# EAGLE schematic main (EAGLE 9.4.2), part 2 of 2
## Sheet 10 of 11: V & F Registers
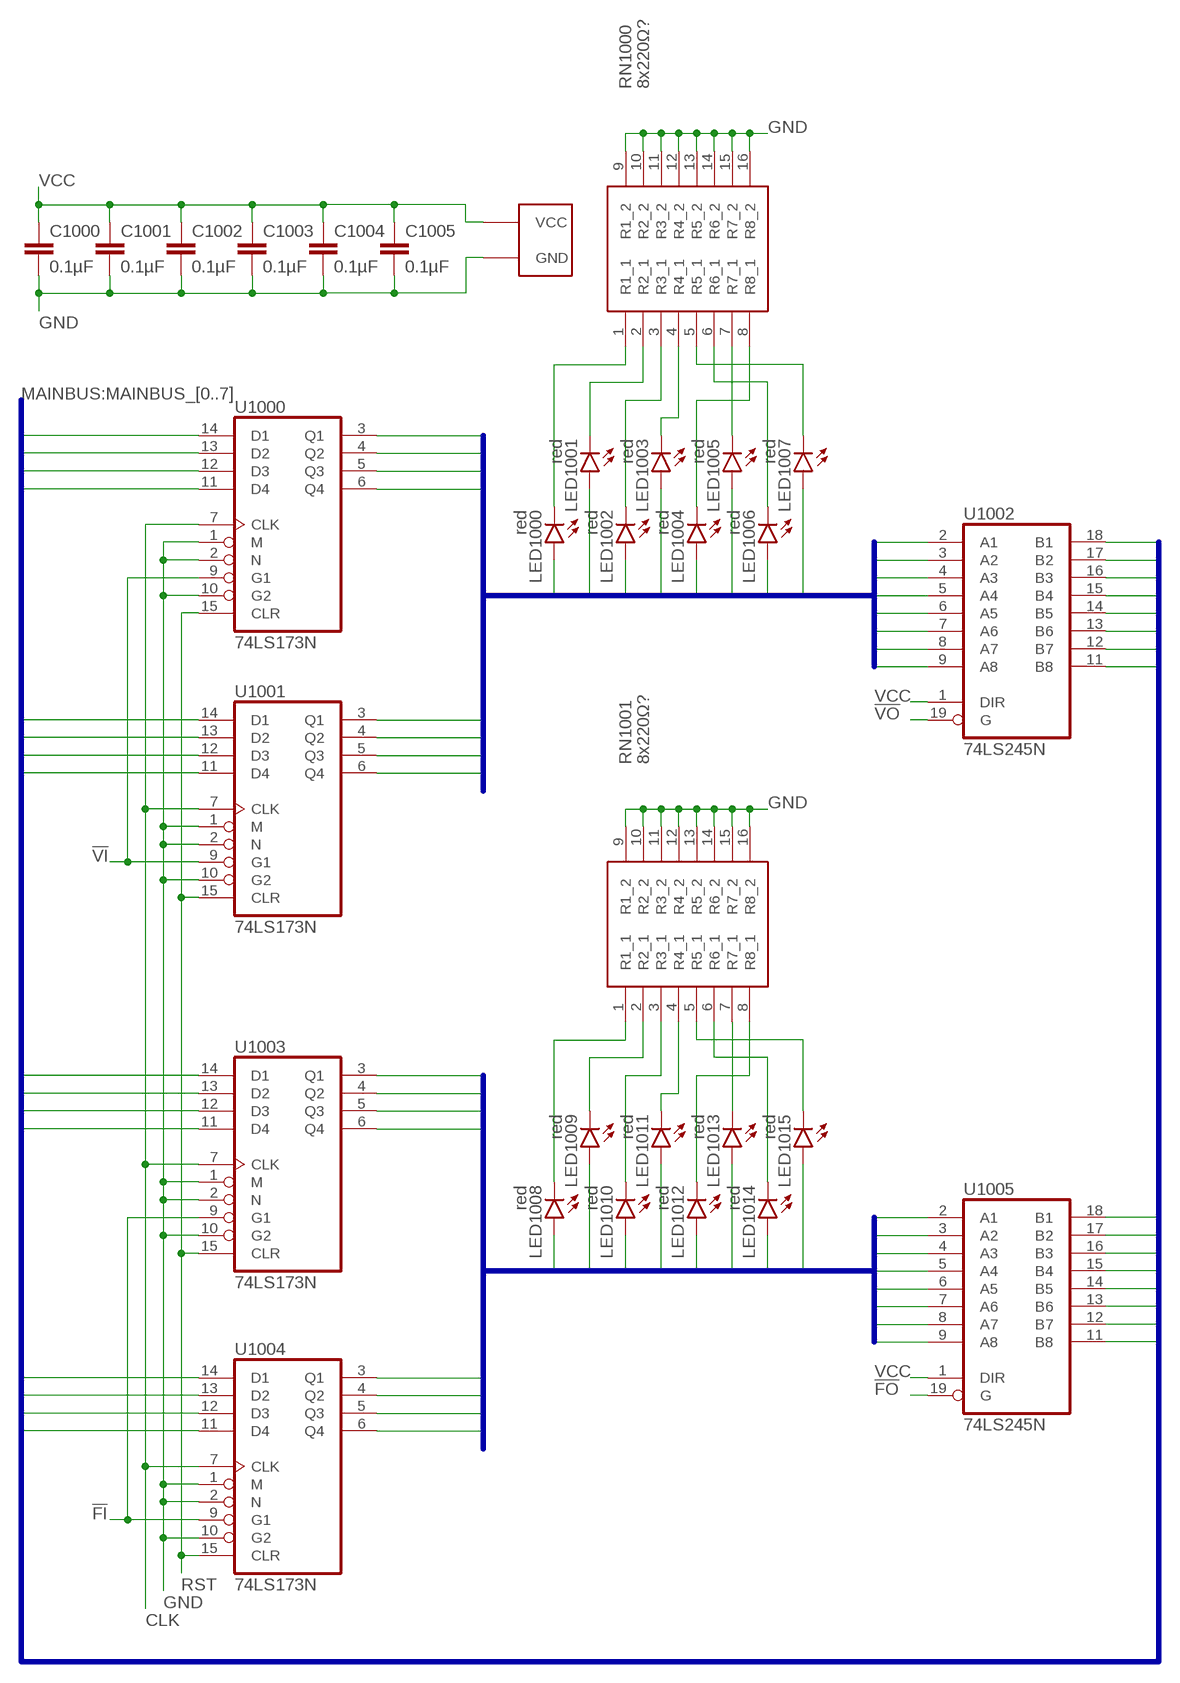
[diagram p10: schematic, sheet 10]

### Parts
C1000  0.1µF  C-EUC0805K  [C0805K]
C1001  0.1µF  C-EUC0805K  [C0805K]
C1002  0.1µF  C-EUC0805K  [C0805K]
C1003  0.1µF  C-EUC0805K  [C0805K]
C1004  0.1µF  C-EUC0805K  [C0805K]
C1005  0.1µF  C-EUC0805K  [C0805K]
LED1000  red  LED3MM  [LED3MM]
LED1001  red  LED3MM  [LED3MM]
LED1002  red  LED3MM  [LED3MM]
LED1003  red  LED3MM  [LED3MM]
LED1004  red  LED3MM  [LED3MM]
LED1005  red  LED3MM  [LED3MM]
LED1006  red  LED3MM  [LED3MM]
LED1007  red  LED3MM  [LED3MM]
LED1008  red  LED3MM  [LED3MM]
LED1009  red  LED3MM  [LED3MM]
LED1010  red  LED3MM  [LED3MM]
LED1011  red  LED3MM  [LED3MM]
LED1012  red  LED3MM  [LED3MM]
LED1013  red  LED3MM  [LED3MM]
LED1014  red  LED3MM  [LED3MM]
LED1015  red  LED3MM  [LED3MM]
RN1000  8x220Ω?  CAY16-102J8LF  [CAY16102J8LF]
RN1001  8x220Ω?  CAY16-102J8LF  [CAY16102J8LF]
U1000  74LS173N  [DIL16]
U1001  74LS173N  [DIL16]
U1002  74LS245N  [DIL20]
U1003  74LS173N  [DIL16]
U1004  74LS173N  [DIL16]
U1005  74LS245N  [DIL20]

### Nets
!FI: U1003.9(G1) U1004.9(G1) ; also sheet 11
!FO: U1005.19(G) ; also sheet 11
!VI: U1000.9(G1) U1001.9(G1) ; also sheet 11
!VO: U1002.19(G) ; also sheet 11
CLK: U1000.7(CLK) U1001.7(CLK) U1003.7(CLK) U1004.7(CLK) ; also sheet 1,2,3,4,5,6,7,9,11
GND: C1000.2 C1001.2 C1002.2 C1003.2 C1004.2 C1005.2 RN1000.9(R1_2) RN1000.10(R2_2) RN1000.11(R3_2) RN1000.12(R4_2) RN1000.13(R5_2) RN1000.14(R6_2) RN1000.15(R7_2) RN1000.16(R8_2) RN1001.9(R1_2) RN1001.10(R2_2) RN1001.11(R3_2) RN1001.12(R4_2) RN1001.13(R5_2) RN1001.14(R6_2) RN1001.15(R7_2) RN1001.16(R8_2) U1000.1(M) U1000.2(N) U1000.10(G2) U1001.1(M) U1001.2(N) U1001.10(G2) U1003.1(M) U1003.2(N) U1003.10(G2) U1004.1(M) U1004.2(N) U1004.10(G2) ; supply symbol labelled SUPPLY ; also sheet 1,2,3,4,5,6,7,8,9,11
LED1000_GND: LED1000.K(C) RN1000.1(R1_1)
LED1001_GND: LED1001.K(C) RN1000.2(R2_1)
LED1002_GND: LED1002.K(C) RN1000.3(R3_1)
LED1003_GND: LED1003.K(C) RN1000.4(R4_1)
LED1004_GND: LED1004.K(C) RN1000.8(R8_1)
LED1005_GND: LED1005.K(C) RN1000.7(R7_1)
LED1006_GND: LED1006.K(C) RN1000.6(R6_1)
LED1007_GND: LED1007.K(C) RN1000.5(R5_1)
LED1008_GND: LED1008.K(C) RN1001.1(R1_1)
LED1009_GND: LED1009.K(C) RN1001.2(R2_1)
LED1010_GND: LED1010.K(C) RN1001.3(R3_1)
LED1011_GND: LED1011.K(C) RN1001.4(R4_1)
LED1012_GND: LED1012.K(C) RN1001.8(R8_1)
LED1013_GND: LED1013.K(C) RN1001.7(R7_1)
LED1014_GND: LED1014.K(C) RN1001.6(R6_1)
LED1015_GND: LED1015.K(C) RN1001.5(R5_1)
MAINBUS_0: U1001.11(D4) U1002.11(B8) U1004.11(D4) U1005.11(B8) ; also sheet 2,3,4,5,6,7,8,9,11
MAINBUS_1: U1001.12(D3) U1002.12(B7) U1004.12(D3) U1005.12(B7) ; also sheet 2,3,4,5,6,7,8,9,11
MAINBUS_2: U1001.13(D2) U1002.13(B6) U1004.13(D2) U1005.13(B6) ; also sheet 2,3,4,5,6,7,8,9,11
MAINBUS_3: U1001.14(D1) U1002.14(B5) U1004.14(D1) U1005.14(B5) ; also sheet 2,3,4,5,6,7,8,9,11
MAINBUS_4: U1000.11(D4) U1002.15(B4) U1003.11(D4) U1005.15(B4) ; also sheet 2,3,4,5,6,7,8,9,11
MAINBUS_5: U1000.12(D3) U1002.16(B3) U1003.12(D3) U1005.16(B3) ; also sheet 2,3,4,5,6,7,8,9,11
MAINBUS_6: U1000.13(D2) U1002.17(B2) U1003.13(D2) U1005.17(B2) ; also sheet 2,3,4,5,6,7,8,9,11
MAINBUS_7: U1000.14(D1) U1002.18(B1) U1003.14(D1) U1005.18(B1) ; also sheet 2,3,4,5,6,7,8,9
REG_F_0: LED1015.A U1004.6(Q4) U1005.9(A8)
REG_F_1: LED1014.A U1004.5(Q3) U1005.8(A7)
REG_F_2: LED1013.A U1004.4(Q2) U1005.7(A6)
REG_F_3: LED1012.A U1004.3(Q1) U1005.6(A5)
REG_F_4: LED1011.A U1003.6(Q4) U1005.5(A4)
REG_F_5: LED1010.A U1003.5(Q3) U1005.4(A3)
REG_F_6: LED1009.A U1003.4(Q2) U1005.3(A2)
REG_F_7: LED1008.A U1003.3(Q1) U1005.2(A1)
REG_V_0: LED1007.A U1001.6(Q4) U1002.9(A8)
REG_V_1: LED1006.A U1001.5(Q3) U1002.8(A7)
REG_V_2: LED1005.A U1001.4(Q2) U1002.7(A6)
REG_V_3: LED1004.A U1001.3(Q1) U1002.6(A5)
REG_V_4: LED1003.A U1000.6(Q4) U1002.5(A4)
REG_V_5: LED1002.A U1000.5(Q3) U1002.4(A3)
REG_V_6: LED1001.A U1000.4(Q2) U1002.3(A2)
REG_V_7: LED1000.A U1000.3(Q1) U1002.2(A1)
RST: U1000.15(CLR) U1001.15(CLR) U1003.15(CLR) U1004.15(CLR) ; also sheet 2,3,5,6,7,9,11
VCC: C1000.1 C1001.1 C1002.1 C1003.1 C1004.1 C1005.1 U1002.1(DIR) U1005.1(DIR) ; supply symbol labelled SUPPLY ; also sheet 1,2,3,4,5,6,7,8,9,11

### Buses
REG_V:REG_V_[0..7]
REG_F:REG_F_[0..7]
MAINBUS:MAINBUS_[0..7]

## Sheet 11 of 11: Instruction Control
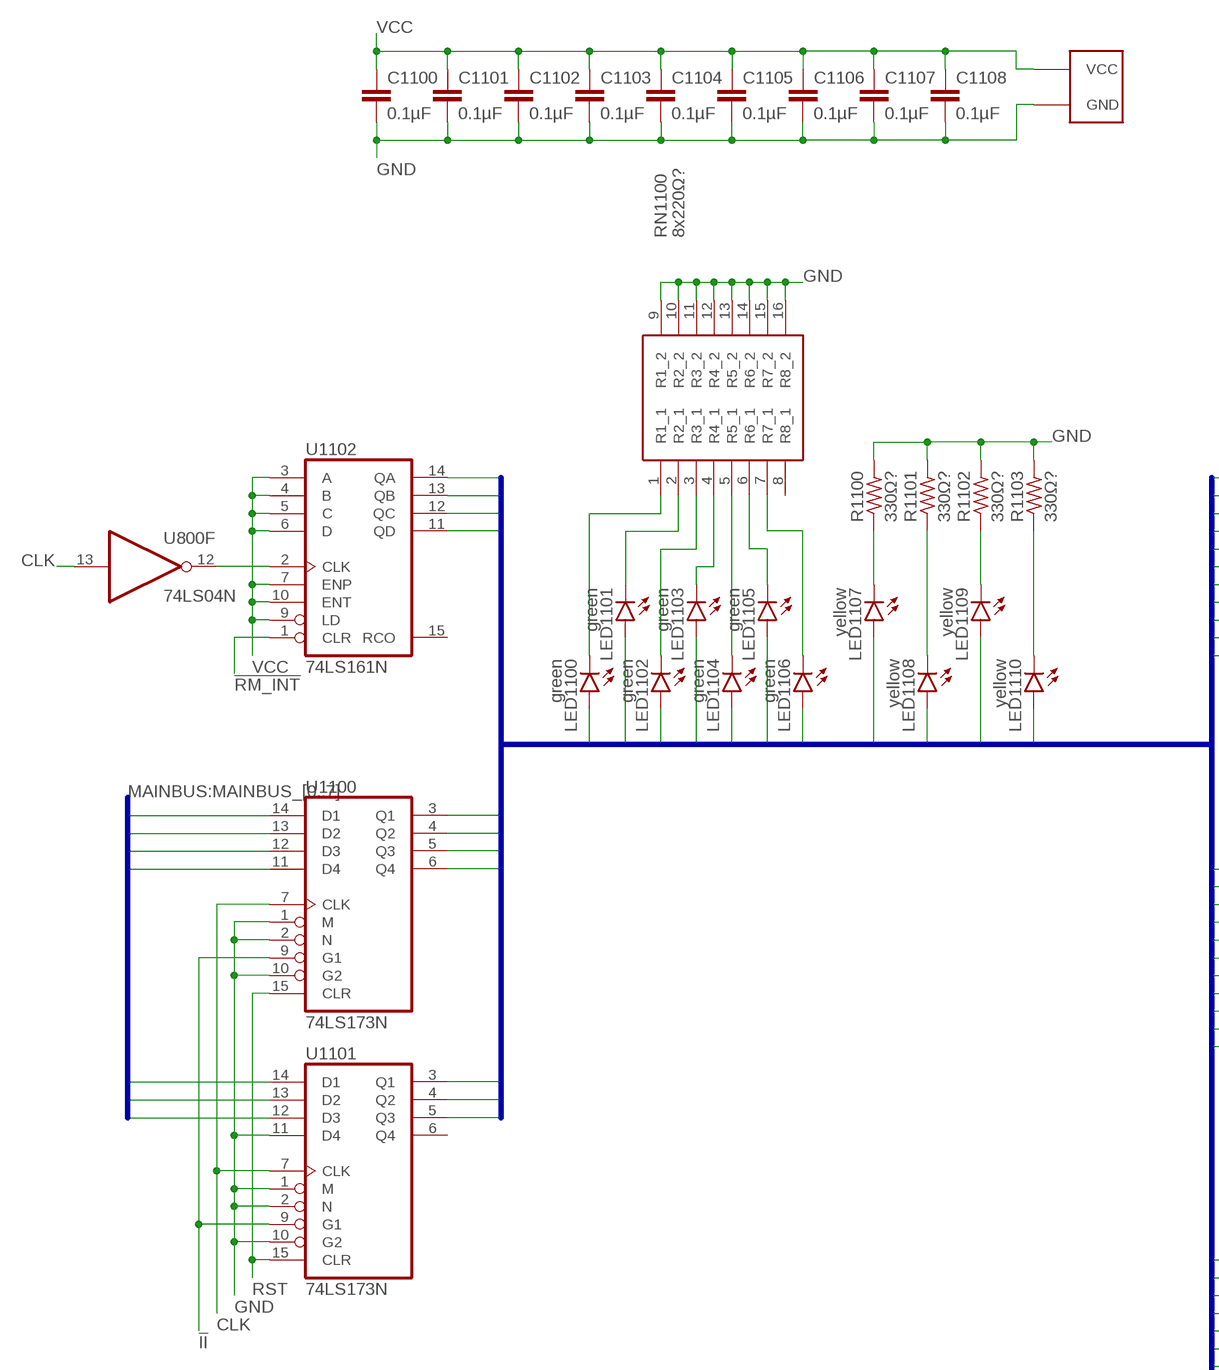
[diagram p11: schematic, sheet 11, part 1 of 2]
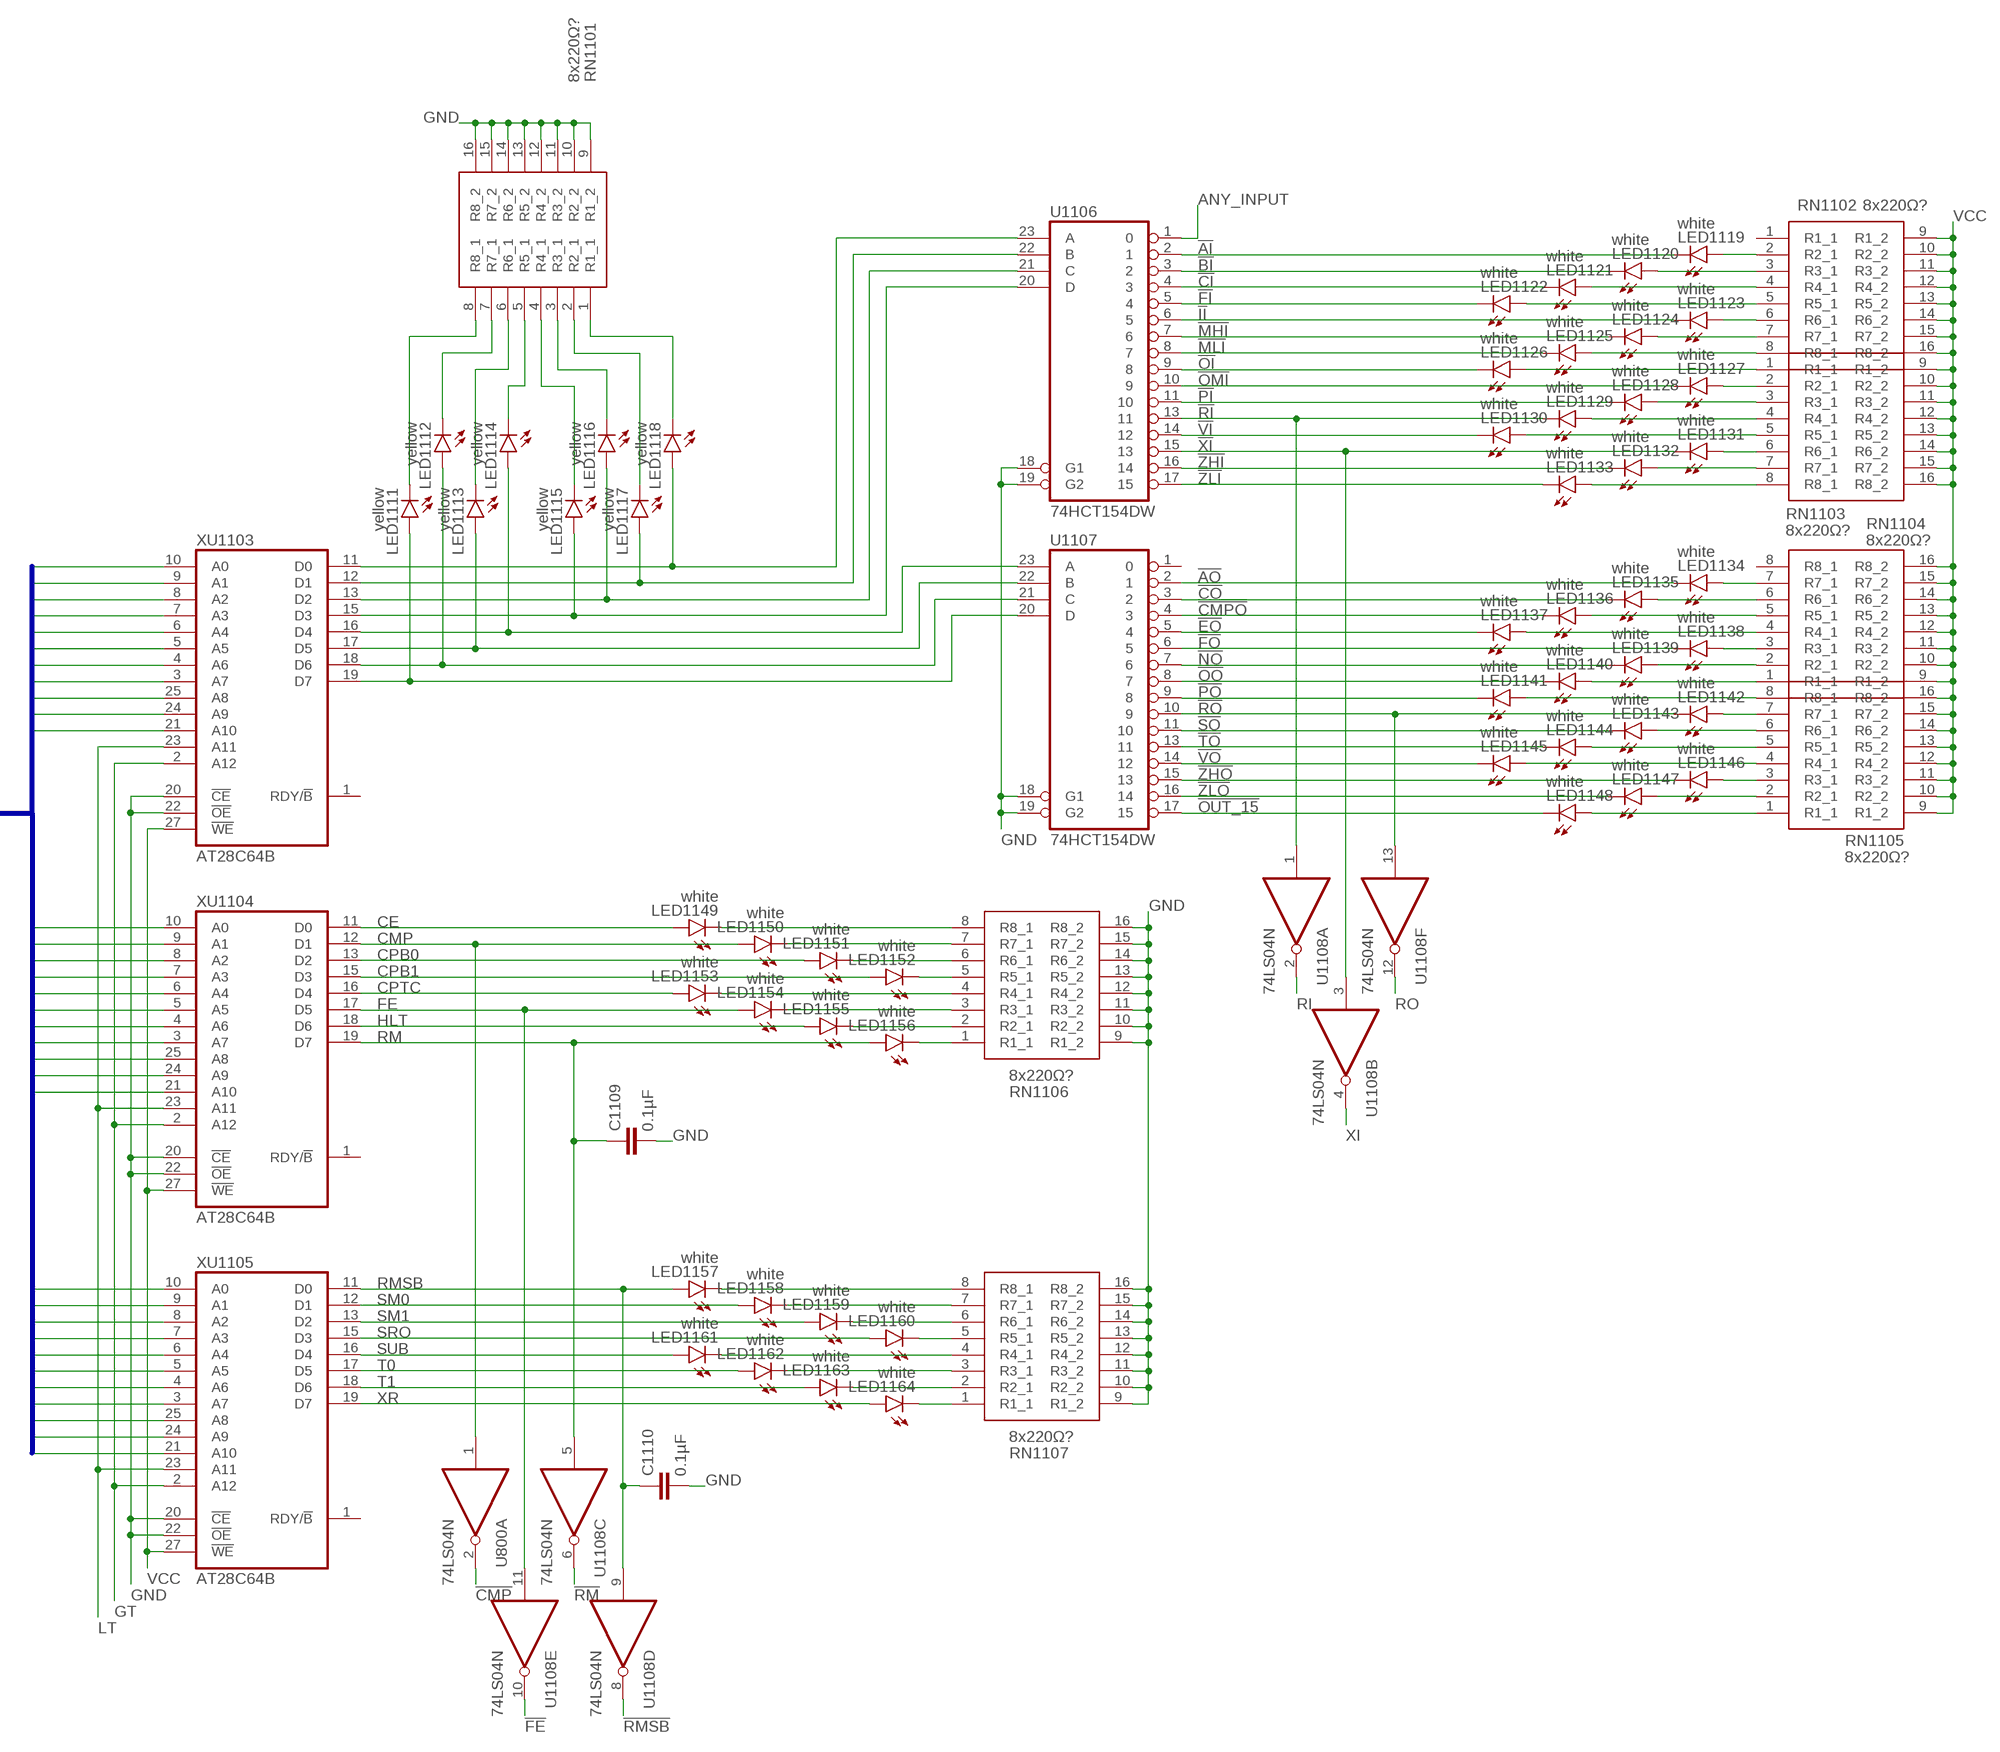
[diagram p12: schematic, sheet 11, part 2 of 2]

### Parts
C1100  0.1µF  C-EUC0805K  [C0805K]
C1101  0.1µF  C-EUC0805K  [C0805K]
C1102  0.1µF  C-EUC0805K  [C0805K]
C1103  0.1µF  C-EUC0805K  [C0805K]
C1104  0.1µF  C-EUC0805K  [C0805K]
C1105  0.1µF  C-EUC0805K  [C0805K]
C1106  0.1µF  C-EUC0805K  [C0805K]
C1107  0.1µF  C-EUC0805K  [C0805K]
C1108  0.1µF  C-EUC0805K  [C0805K]
C1109  0.1µF  C-EUC0805K  [C0805K]
C1110  0.1µF  C-EUC0805K  [C0805K]
LED1100  green  LED3MM  [LED3MM]
LED1101  green  LED3MM  [LED3MM]
LED1102  green  LED3MM  [LED3MM]
LED1103  green  LED3MM  [LED3MM]
LED1104  green  LED3MM  [LED3MM]
LED1105  green  LED3MM  [LED3MM]
LED1106  green  LED3MM  [LED3MM]
LED1107  yellow  LED3MM  [LED3MM]
LED1108  yellow  LED3MM  [LED3MM]
LED1109  yellow  LED3MM  [LED3MM]
LED1110  yellow  LED3MM  [LED3MM]
LED1111  yellow  LED3MM  [LED3MM]
LED1112  yellow  LED3MM  [LED3MM]
LED1113  yellow  LED3MM  [LED3MM]
LED1114  yellow  LED3MM  [LED3MM]
LED1115  yellow  LED3MM  [LED3MM]
LED1116  yellow  LED3MM  [LED3MM]
LED1117  yellow  LED3MM  [LED3MM]
LED1118  yellow  LED3MM  [LED3MM]
LED1119  white  LED3MM  [LED3MM]
LED1120  white  LED3MM  [LED3MM]
LED1121  white  LED3MM  [LED3MM]
LED1122  white  LED3MM  [LED3MM]
LED1123  white  LED3MM  [LED3MM]
LED1124  white  LED3MM  [LED3MM]
LED1125  white  LED3MM  [LED3MM]
LED1126  white  LED3MM  [LED3MM]
LED1127  white  LED3MM  [LED3MM]
LED1128  white  LED3MM  [LED3MM]
LED1129  white  LED3MM  [LED3MM]
LED1130  white  LED3MM  [LED3MM]
LED1131  white  LED3MM  [LED3MM]
LED1132  white  LED3MM  [LED3MM]
LED1133  white  LED3MM  [LED3MM]
LED1134  white  LED3MM  [LED3MM]
LED1135  white  LED3MM  [LED3MM]
LED1136  white  LED3MM  [LED3MM]
LED1137  white  LED3MM  [LED3MM]
LED1138  white  LED3MM  [LED3MM]
LED1139  white  LED3MM  [LED3MM]
LED1140  white  LED3MM  [LED3MM]
LED1141  white  LED3MM  [LED3MM]
LED1142  white  LED3MM  [LED3MM]
LED1143  white  LED3MM  [LED3MM]
LED1144  white  LED3MM  [LED3MM]
LED1145  white  LED3MM  [LED3MM]
LED1146  white  LED3MM  [LED3MM]
LED1147  white  LED3MM  [LED3MM]
LED1148  white  LED3MM  [LED3MM]
LED1149  white  LED3MM  [LED3MM]
LED1150  white  LED3MM  [LED3MM]
LED1151  white  LED3MM  [LED3MM]
LED1152  white  LED3MM  [LED3MM]
LED1153  white  LED3MM  [LED3MM]
LED1154  white  LED3MM  [LED3MM]
LED1155  white  LED3MM  [LED3MM]
LED1156  white  LED3MM  [LED3MM]
LED1157  white  LED3MM  [LED3MM]
LED1158  white  LED3MM  [LED3MM]
LED1159  white  LED3MM  [LED3MM]
LED1160  white  LED3MM  [LED3MM]
LED1161  white  LED3MM  [LED3MM]
LED1162  white  LED3MM  [LED3MM]
LED1163  white  LED3MM  [LED3MM]
LED1164  white  LED3MM  [LED3MM]
R1100  330Ω?  R-US_R0805  [R0805]
R1101  330Ω?  R-US_R0805  [R0805]
R1102  330Ω?  R-US_R0805  [R0805]
R1103  330Ω?  R-US_R0805  [R0805]
RN1100  8x220Ω?  CAY16-102J8LF  [CAY16102J8LF]
RN1101  8x220Ω?  CAY16-102J8LF  [CAY16102J8LF]
RN1102  8x220Ω?  CAY16-102J8LF  [CAY16102J8LF]
RN1103  8x220Ω?  CAY16-102J8LF  [CAY16102J8LF]
RN1104  8x220Ω?  CAY16-102J8LF  [CAY16102J8LF]
RN1105  8x220Ω?  CAY16-102J8LF  [CAY16102J8LF]
RN1106  8x220Ω?  CAY16-102J8LF  [CAY16102J8LF]
RN1107  8x220Ω?  CAY16-102J8LF  [CAY16102J8LF]
U1100  74LS173N  [DIL16]
U1101  74LS173N  [DIL16]
U1102  74LS161N  [DIL16]
U1106  74HCT154DW  74154DW  [SO24W]
U1107  74HCT154DW  74154DW  [SO24W]
U1108  74LS04N  [DIL14]
XU1103  AT28C64B  2864  [DIL28]
XU1104  AT28C64B  2864  [DIL28]
XU1105  AT28C64B  2864  [DIL28]

### Nets
!AI: LED1119.K(C) U1106.2 ; also sheet 6
!AO: LED1134.K(C) U1107.2 ; also sheet 6
!BI: LED1120.K(C) U1106.3 ; also sheet 6
!CI: LED1121.K(C) U1106.4 ; also sheet 4
!CLK: U800.12(F:O) U1102.2(CLK)
!CMP: U800.2(A:O) ; also sheet 7
!CMPO: LED1136.K(C) U1107.4 ; also sheet 7
!CO: LED1135.K(C) U1107.3 ; also sheet 4
!EO: LED1137.K(C) U1107.5 ; also sheet 7
!FE: U1108.10(E:O) ; also sheet 3
!FI: LED1122.K(C) U1106.5 ; also sheet 10
!FO: LED1138.K(C) U1107.6 ; also sheet 10
!II: LED1123.K(C) U1100.9(G1) U1101.9(G1) U1106.6
!MHI: LED1124.K(C) U1106.7 ; also sheet 2
!MLI: LED1125.K(C) U1106.8 ; also sheet 2
!NO: LED1139.K(C) U1107.7 ; also sheet 2,5
!OI: LED1126.K(C) U1106.9 ; also sheet 9
!OMI: LED1127.K(C) U1106.10 ; also sheet 9
!OO: LED1140.K(C) U1107.8 ; also sheet 3
!OUT_15: LED1148.K(C) U1107.17
!PI: LED1128.K(C) U1106.11 ; also sheet 4
!PO: LED1141.K(C) U1107.9 ; also sheet 4
!RI: LED1129.K(C) U1106.13 U1108.1(A:I)
!RM: U1108.6(C:O) ; also sheet 3
!RM_INT: U1102.1(CLR) ; also sheet 3
!RMSB: U1108.8(D:O) ; also sheet 3
!RO: LED1142.K(C) U1107.10 U1108.13(F:I)
!SO: LED1143.K(C) U1107.11 ; also sheet 3
!TO: LED1144.K(C) U1107.13 ; also sheet 8
!VI: LED1130.K(C) U1106.14 ; also sheet 10
!VO: LED1145.K(C) U1107.14 ; also sheet 10
!XI: LED1131.K(C) U1106.15 U1108.3(B:I)
!ZHI: LED1132.K(C) U1106.16 ; also sheet 2
!ZHO: LED1146.K(C) U1107.15 ; also sheet 2
!ZLI: LED1133.K(C) U1106.17 ; also sheet 2
!ZLO: LED1147.K(C) U1107.16 ; also sheet 2
ANY_INPUT: U1106.1 ; also sheet 2,5
CE: LED1149.A XU1104.11(D0) ; also sheet 4
CLK: U800.13(F:I) U1100.7(CLK) U1101.7(CLK) ; also sheet 1,2,3,4,5,6,7,9,10
CMP: LED1150.A U800.1(A:I) XU1104.12(D1)
CPB0: LED1151.A XU1104.13(D2) ; also sheet 7
CPB1: LED1152.A XU1104.15(D3) ; also sheet 7
CPTC: LED1153.A XU1104.16(D4) ; also sheet 7
FE: LED1154.A U1108.11(E:I) XU1104.17(D5)
GND: C1100.2 C1101.2 C1102.2 C1103.2 C1104.2 C1105.2 C1106.2 C1107.2 C1108.2 C1109.2 C1110.2 R1100.2 R1101.2 R1102.2 R1103.2 RN1100.9(R1_2) RN1100.10(R2_2) RN1100.11(R3_2) RN1100.12(R4_2) RN1100.13(R5_2) RN1100.14(R6_2) RN1100.15(R7_2) RN1100.16(R8_2) RN1101.9(R1_2) RN1101.10(R2_2) RN1101.11(R3_2) RN1101.12(R4_2) RN1101.13(R5_2) RN1101.14(R6_2) RN1101.15(R7_2) RN1101.16(R8_2) RN1106.9(R1_2) RN1106.10(R2_2) RN1106.11(R3_2) RN1106.12(R4_2) RN1106.13(R5_2) RN1106.14(R6_2) RN1106.15(R7_2) RN1106.16(R8_2) RN1107.9(R1_2) RN1107.10(R2_2) RN1107.11(R3_2) RN1107.12(R4_2) RN1107.13(R5_2) RN1107.14(R6_2) RN1107.15(R7_2) RN1107.16(R8_2) U1100.1(M) U1100.2(N) U1100.10(G2) U1101.1(M) U1101.2(N) U1101.10(G2) U1101.11(D4) U1106.18(G1) U1106.19(G2) U1107.18(G1) U1107.19(G2) XU1103.20(!CE) XU1103.22(!OE) XU1104.20(!CE) XU1104.22(!OE) XU1105.20(!CE) XU1105.22(!OE) ; supply symbol labelled SUPPLY ; also sheet 1,2,3,4,5,6,7,8,9,10
GT: XU1103.2(A12) XU1104.2(A12) XU1105.2(A12) ; also sheet 7
HLT: LED1155.A XU1104.18(D6) ; also sheet 1
IN_INDEX_0: LED1118.A U1106.23(A) XU1103.11(D0)
IN_INDEX_1: LED1117.A U1106.22(B) XU1103.12(D1)
IN_INDEX_2: LED1116.A U1106.21(C) XU1103.13(D2)
IN_INDEX_3: LED1115.A U1106.20(D) XU1103.15(D3)
INT_INSTR_I_0: LED1106.A U1100.3(Q1) XU1103.6(A4) XU1104.6(A4) XU1105.6(A4)
INT_INSTR_I_1: LED1105.A U1100.4(Q2) XU1103.5(A5) XU1104.5(A5) XU1105.5(A5)
INT_INSTR_I_2: LED1104.A U1100.5(Q3) XU1103.4(A6) XU1104.4(A6) XU1105.4(A6)
INT_INSTR_I_3: LED1103.A U1100.6(Q4) XU1103.3(A7) XU1104.3(A7) XU1105.3(A7)
INT_INSTR_I_4: LED1102.A U1101.3(Q1) XU1103.25(A8) XU1104.25(A8) XU1105.25(A8)
INT_INSTR_I_5: LED1101.A U1101.4(Q2) XU1103.24(A9) XU1104.24(A9) XU1105.24(A9)
INT_INSTR_I_6: LED1100.A U1101.5(Q3) XU1103.21(A10) XU1104.21(A10) XU1105.21(A10)
INT_INSTR_M_0: LED1110.A U1102.14(QA) XU1103.10(A0) XU1104.10(A0) XU1105.10(A0)
INT_INSTR_M_1: LED1109.A U1102.13(QB) XU1103.9(A1) XU1104.9(A1) XU1105.9(A1)
INT_INSTR_M_2: LED1108.A U1102.12(QC) XU1103.8(A2) XU1104.8(A2) XU1105.8(A2)
INT_INSTR_M_3: LED1107.A U1102.11(QD) XU1103.7(A3) XU1104.7(A3) XU1105.7(A3)
LED1100_GND: LED1100.K(C) RN1100.1(R1_1)
LED1101_GND: LED1101.K(C) RN1100.2(R2_1)
LED1102_GND: LED1102.K(C) RN1100.3(R3_1)
LED1103_GND: LED1103.K(C) RN1100.4(R4_1)
LED1104_GND: LED1104.K(C) RN1100.5(R5_1)
LED1105_GND: LED1105.K(C) RN1100.6(R6_1)
LED1106_GND: LED1106.K(C) RN1100.7(R7_1)
LED1107_GND: LED1107.K(C) R1100.1
LED1108_GND: LED1108.K(C) R1101.1
LED1109_GND: LED1109.K(C) R1102.1
LED1110_GND: LED1110.K(C) R1103.1
LED1111_GND: LED1111.K(C) RN1101.8(R8_1)
LED1112_GND: LED1112.K(C) RN1101.7(R7_1)
LED1113_GND: LED1113.K(C) RN1101.6(R6_1)
LED1114_GND: LED1114.K(C) RN1101.5(R5_1)
LED1115_GND: LED1115.K(C) RN1101.4(R4_1)
LED1116_GND: LED1116.K(C) RN1101.3(R3_1)
LED1117_GND: LED1117.K(C) RN1101.2(R2_1)
LED1118_GND: LED1118.K(C) RN1101.1(R1_1)
LED1119_VCC: LED1119.A RN1102.2(R2_1)
LED1120_VCC: LED1120.A RN1102.3(R3_1)
LED1121_VCC: LED1121.A RN1102.4(R4_1)
LED1122_VCC: LED1122.A RN1102.5(R5_1)
LED1123_VCC: LED1123.A RN1102.6(R6_1)
LED1124_VCC: LED1124.A RN1102.7(R7_1)
LED1125_VCC: LED1125.A RN1102.8(R8_1)
LED1126_VCC: LED1126.A RN1103.1(R1_1)
LED1127_VCC: LED1127.A RN1103.2(R2_1)
LED1128_VCC: LED1128.A RN1103.3(R3_1)
LED1129_VCC: LED1129.A RN1103.4(R4_1)
LED1130_VCC: LED1130.A RN1103.5(R5_1)
LED1131_VCC: LED1131.A RN1103.6(R6_1)
LED1132_VCC: LED1132.A RN1103.7(R7_1)
LED1133_VCC: LED1133.A RN1103.8(R8_1)
LED1134_VCC: LED1134.A RN1104.7(R7_1)
LED1135_VCC: LED1135.A RN1104.6(R6_1)
LED1136_VCC: LED1136.A RN1104.5(R5_1)
LED1137_VCC: LED1137.A RN1104.4(R4_1)
LED1138_VCC: LED1138.A RN1104.3(R3_1)
LED1139_VCC: LED1139.A RN1104.2(R2_1)
LED1140_VCC: LED1140.A RN1104.1(R1_1)
LED1141_VCC: LED1141.A RN1105.8(R8_1)
LED1142_VCC: LED1142.A RN1105.7(R7_1)
LED1143_VCC: LED1143.A RN1105.6(R6_1)
LED1144_VCC: LED1144.A RN1105.5(R5_1)
LED1145_VCC: LED1145.A RN1105.4(R4_1)
LED1146_VCC: LED1146.A RN1105.3(R3_1)
LED1147_VCC: LED1147.A RN1105.2(R2_1)
LED1148_VCC: LED1148.A RN1105.1(R1_1)
LED1149_GND: LED1149.K(C) RN1106.8(R8_1)
LED1150_GND: LED1150.K(C) RN1106.7(R7_1)
LED1151_GND: LED1151.K(C) RN1106.6(R6_1)
LED1152_GND: LED1152.K(C) RN1106.5(R5_1)
LED1153_GND: LED1153.K(C) RN1106.4(R4_1)
LED1154_GND: LED1154.K(C) RN1106.3(R3_1)
LED1155_GND: LED1155.K(C) RN1106.2(R2_1)
LED1156_GND: LED1156.K(C) RN1106.1(R1_1)
LED1157_GND: LED1157.K(C) RN1107.8(R8_1)
LED1158_GND: LED1158.K(C) RN1107.7(R7_1)
LED1159_GND: LED1159.K(C) RN1107.6(R6_1)
LED1160_GND: LED1160.K(C) RN1107.5(R5_1)
LED1161_GND: LED1161.K(C) RN1107.4(R4_1)
LED1162_GND: LED1162.K(C) RN1107.3(R3_1)
LED1163_GND: LED1163.K(C) RN1107.2(R2_1)
LED1164_GND: LED1164.K(C) RN1107.1(R1_1)
LT: XU1103.23(A11) XU1104.23(A11) XU1105.23(A11) ; also sheet 7
MAINBUS_0: U1100.14(D1) ; also sheet 2,3,4,5,6,7,8,9,10
MAINBUS_1: U1100.13(D2) ; also sheet 2,3,4,5,6,7,8,9,10
MAINBUS_2: U1100.12(D3) ; also sheet 2,3,4,5,6,7,8,9,10
MAINBUS_3: U1100.11(D4) ; also sheet 2,3,4,5,6,7,8,9,10
MAINBUS_4: U1101.14(D1) ; also sheet 2,3,4,5,6,7,8,9,10
MAINBUS_5: U1101.13(D2) ; also sheet 2,3,4,5,6,7,8,9,10
MAINBUS_6: U1101.12(D3) ; also sheet 2,3,4,5,6,7,8,9,10
OUT_INDEX_0: LED1114.A U1107.23(A) XU1103.16(D4)
OUT_INDEX_1: LED1113.A U1107.22(B) XU1103.17(D5)
OUT_INDEX_2: LED1112.A U1107.21(C) XU1103.18(D6)
OUT_INDEX_3: LED1111.A U1107.20(D) XU1103.19(D7)
RI: U1108.2(A:O) ; also sheet 2
RM: C1109.1 LED1156.A U1108.5(C:I) XU1104.19(D7)
RMSB: C1110.1 LED1157.A U1108.9(D:I) XU1105.11(D0)
RO: U1108.12(F:O) ; also sheet 2
RST: U1100.15(CLR) U1101.15(CLR) ; also sheet 2,3,5,6,7,9,10
SM0: LED1158.A XU1105.12(D1) ; also sheet 3
SM1: LED1159.A XU1105.13(D2) ; also sheet 3
SRO: LED1160.A XU1105.15(D3) ; also sheet 3
SUB: LED1161.A XU1105.16(D4) ; also sheet 7
T0: LED1162.A XU1105.17(D5) ; also sheet 8
T1: LED1163.A XU1105.18(D6) ; also sheet 8
VCC: C1100.1 C1101.1 C1102.1 C1103.1 C1104.1 C1105.1 C1106.1 C1107.1 C1108.1 RN1102.9(R1_2) RN1102.10(R2_2) RN1102.11(R3_2) RN1102.12(R4_2) RN1102.13(R5_2) RN1102.14(R6_2) RN1102.15(R7_2) RN1102.16(R8_2) RN1103.9(R1_2) RN1103.10(R2_2) RN1103.11(R3_2) RN1103.12(R4_2) RN1103.13(R5_2) RN1103.14(R6_2) RN1103.15(R7_2) RN1103.16(R8_2) RN1104.9(R1_2) RN1104.10(R2_2) RN1104.11(R3_2) RN1104.12(R4_2) RN1104.13(R5_2) RN1104.14(R6_2) RN1104.15(R7_2) RN1104.16(R8_2) RN1105.9(R1_2) RN1105.10(R2_2) RN1105.11(R3_2) RN1105.12(R4_2) RN1105.13(R5_2) RN1105.14(R6_2) RN1105.15(R7_2) RN1105.16(R8_2) U1102.3(A) U1102.4(B) U1102.5(C) U1102.6(D) U1102.7(ENP) U1102.9(LD) U1102.10(ENT) XU1103.27(!WE) XU1104.27(!WE) XU1105.27(!WE) ; supply symbol labelled SUPPLY ; also sheet 1,2,3,4,5,6,7,8,9,10
XI: U1108.4(B:O) ; also sheet 5
XR: LED1164.A XU1105.19(D7) ; also sheet 5
Unconnected: RN1100.8(R8_1) RN1102.1(R1_1) RN1104.8(R8_1) U1101.6(Q4) U1102.15(RCO) U1107.1 XU1103.1(RDY/!B) XU1104.1(RDY/!B) XU1105.1(RDY/!B)

### Buses
MAINBUS:MAINBUS_[0..7]
INT_INSTR:INT_INSTR_I_[0..6],INT_INSTR_M_[0..3]

## Power pins joined to a net without a drawn wire
GND: U103.7(P:GND) U104.7(P:GND) U105.7(P:GND) U201.8(GND) U202.8(GND) U203.8(GND) U204.8(GND) U205.8(GND) U206.8(GND) U207.8(GND) U208.8(GND) U209.8(GND) U210.8(GND) U211.8(GND) U212.10(GND) U213.10(GND) U214.7(P:GND) U215.8(GND) U216.8(GND) U217.8(GND) U218.8(GND) U219.10(GND) U220.10(GND) U300.10(GND) U301.10(GND) U302.7(P:GND) U303.7(P:GND) U304.10(GND) U400.7(P:GND) U401.10(GND) U500.8(GND) U501.8(GND) U502.8(GND) U503.8(GND) U504.10(GND) U505.10(GND) U600.8(GND) U601.8(GND) U602.8(GND) U603.8(GND) U604.10(GND) U700.8(GND) U701.8(GND) U702.10(GND) U703.7(P:GND) U704.7(P:GND) U705.8(GND) U706.8(GND) U707.8(GND) U708.7(P:GND) U709.8(GND) U800.7(P:GND) U801.7(P:GND) U802.7(P:GND) U803.7(P:GND) U804.7(P:GND) U805.7(P:GND) U806.7(P:GND) U807.7(P:GND) U808.8(GND) U809.8(GND) U810.8(GND) U811.8(GND) U812.10(GND) U901.8(GND) U902.8(P:GND) U903.8(GND) U904.8(GND) U906.8(GND) U1000.8(GND) U1001.8(GND) U1002.10(GND) U1003.8(GND) U1004.8(GND) U1005.10(GND) U1100.8(GND) U1101.8(GND) U1102.8(GND) U1106.12(GND) U1107.12(GND) U1108.7(P:GND) XU905.14(GND) XU1103.14(GND) XU1104.14(GND) XU1105.14(GND)
VCC: U103.14(P:VCC) U104.14(P:VCC) U105.14(P:VCC) U201.16(VCC) U202.16(VCC) U203.16(VCC) U204.16(VCC) U205.16(VCC) U206.16(VCC) U207.16(VCC) U208.16(VCC) U209.16(VCC) U210.16(VCC) U211.16(VCC) U212.20(VCC) U213.20(VCC) U214.14(P:VCC) U215.16(VCC) U216.16(VCC) U217.16(VCC) U218.16(VCC) U219.20(VCC) U220.20(VCC) U300.20(VCC) U301.20(VCC) U302.14(P:VCC) U303.14(P:VCC) U304.20(VCC) U400.14(P:VCC) U401.20(VCC) U500.16(VCC) U501.16(VCC) U502.16(VCC) U503.16(VCC) U504.20(VCC) U505.20(VCC) U600.16(VCC) U601.16(VCC) U602.16(VCC) U603.16(VCC) U604.20(VCC) U700.16(VCC) U701.16(VCC) U702.20(VCC) U703.14(P:VCC) U704.14(P:VCC) U705.16(VCC) U706.16(VCC) U707.16(VCC) U708.14(P:VCC) U709.16(VCC) U800.14(P:VCC) U801.14(P:VCC) U802.14(P:VCC) U803.14(P:VCC) U804.14(P:VCC) U805.14(P:VCC) U806.14(P:VCC) U807.14(P:VCC) U808.16(VCC) U809.16(VCC) U810.16(VCC) U811.16(VCC) U812.20(VCC) U901.16(VCC) U902.16(P:VCC) U903.16(VCC) U904.16(VCC) U906.16(VCC) U1000.16(VCC) U1001.16(VCC) U1002.20(VCC) U1003.16(VCC) U1004.16(VCC) U1005.20(VCC) U1100.16(VCC) U1101.16(VCC) U1102.16(VCC) U1106.24(VCC) U1107.24(VCC) U1108.14(P:VCC) XU905.28(VCC) XU1103.28(VCC) XU1104.28(VCC) XU1105.28(VCC)

## Library data of the parts
A200 = BW-Active:ARDUINO_NANO_V3
C100-C110 C200-C221 C300-C304 C400-C403 C500-C505 C600-C604 C700-C709 C800-C812 C900-C908 C1000-C1005 C1100-C1110 = rcl:C-EU: CAPACITOR, European symbol; SPICEPREFIX: C
DS400 = BW-Active:HD44780_LCD: Character LCD based on HD44780 chip
DS900-DS903 = BW-Active:LED_7SEG_CC
J100 = con-jack:DCJ0202: DC POWER JACK Source: DCJ0202.pdf; OC_FARNELL: unknown; OC_NEWARK: unknown
J400 = BW-Connectors:90152-14: Right angle 2.54mm socket connector, 7x2 pins
LED100 LED101 LED200-LED240 LED300-LED315 LED400 LED500-LED515 LED600-LED615 LED700-LED711 LED800-LED807 LED900-LED902 LED1000-LED1015 LED1100-LED1164 = led:LED: LED OSRAM: - CHIPLED LG R971, LG N971, LY N971, LG Q971, LY Q971, LO R971, LY R971 LH N974, LH R974 LS Q976, LO Q976, LY Q976 LO Q996 - Hyper CHIPLED LW Q18S LB Q993, LB Q99A, LB R99A - SideLED LS A670, LO A670, LY A670, LG A670, LP A670 LB A673, LV A673, LT A673, LW A673 LH A674 LY A675 LS A676, LA A676, LO A676, LY A676, LW A676 LS A679, LY A679, LG A679 - Hyper Micro SIDELED® LS Y876, LA Y876, LO Y876, LY Y876 LT Y87S - SmartLED LW L88C, LW L88S LB L89C, LB L89S, LG L890 LS L89K, LO L89K, LY L89K LS L896, LA L896, LO L896, LY L896 - TOPLED LS T670, LO T670, LY T670, LG T670, LP T670 LSG T670, LSP T670, LSY T670, LOP T670, LYG T670 LG T671, LOG T671, LSG T671 LB T673, LV T673, LT T673, LW T673 LH T674 LS T676, LA T676, LO T676, LY T676, LB T676, LH T676, LSB T676, LW T676 LB T67C, LV T67C, LT T67C, LS T67K, LO T67K, LY T67K, LW E67C LS E67B, LA E67B, LO E67B, LY E67B, LB E67C, LV E67C, LT E67C LW T67C LS T679, LY T679, LG T679 LS T770, LO T770, LY T770, LG T770, LP T770 LB T773, LV T773, LT T773, LW T773 LH T774 LS E675, LA E675, LY E675, LS T675 LS T776, LA T776, LO T776, LY T776, LB T776 LHGB T686 LT T68C, LB T68C - Hyper Mini TOPLED® LB M676 - Mini TOPLED Santana® LG M470 LS M47K, LO M47K, LY M47K Source: http://www.osram.convergy.de LUXEON: - LUMILED® LXK2-PW12-R00, LXK2-PW12-S00, LXK2-PW14-U00, LXK2-PW14-V00 LXK2-PM12-R00, LXK2-PM12-S00, LXK2-PM14-U00 LXK2-PE12-Q00, LXK2-PE12-R00, LXK2-PE12-S00, LXK2-PE14-T00, LXK2-PE14-U00 LXK2-PB12-K00, LXK2-PB12-L00, LXK2-PB12-M00, LXK2-PB14-N00, LXK2-PB14-P00, LXK2-PB14-Q00 LXK2-PR12-L00, LXK2-PR12-M00, LXK2-PR14-Q00, LXK2-PR14-R00 LXK2-PD12-Q00, LXK2-PD12-R00, LXK2-PD12-S00 LXK2-PH12-R00, LXK2-PH12-S00 LXK2-PL12-P00, LXK2-PL12-Q00, LXK2-PL12-R00 Source: www.luxeon.com KINGBRIGHT: KA-3528ASYC Source: www.kingbright.com
Q200 Q401-Q403 = BW-Active:SOT23-N-MOSFET
Q201 Q300 Q400 = BW-Active:SOT23-P-MOSFET
R100-R107 R200-R211 R300 R301 R400-R405 R700-R703 R900-R904 R1100-R1103 = resistor:R-US_: RESISTOR, American symbol
RN200-RN207 RN300-RN302 RN400 RN500 RN501 RN600 RN601 RN700 RN800 RN900 RN1000 RN1001 RN1100-RN1107 = BW-PassiveMechanical:CAY16-102J8LF: Resistor Networks & Arrays 1K 5% Convex 8resistors Source: Datasheet <https://componentsearchengine.com/Datasheets/1/CAY16-102J8LF.pdf>; DESCRIPTION: Resistor Networks & Arrays 1K 5% Convex 8resistors; HEIGHT: 0mm; MANUFACTURER_NAME: Bourns; MANUFACTURER_PART_NUMBER: CAY16-102J8LF; MOUSER_PART_NUMBER: 652-CAY16-102J8LF; MOUSER_PRICE-STOCK: https://www.mouser.com/Search/Refine.aspx?Keyword=652-CAY16-102J8LF
RV100 RV400 = pot:TRIM_US-: POTENTIOMETER
S100 S204 S300 S401 = BW-PassiveMechanical:TL3305: Tactile microswitch
S101 S200 = BW-PassiveMechanical:ESP10: Slide switch, on-on
S201-S203 S400 = BW-PassiveMechanical:DS-08: 8x DIP switches
U100-U102 U900 = linear:*555: TIMER
U103 U800 U801 U1108 = 74xx-us:74*04: Hex INVERTER
U104 U302 U802 U803 = 74xx-us:74*08: Quad 2-input AND gate
U105 U804 U805 = 74xx-us:74*32: Quad 2-input OR gate
U200 = memory-hitachi:62256P: MEMORY; OC_FARNELL: unknown; OC_NEWARK: unknown
U201-U204 U215-U218 U600-U603 U707 U903 U904 U906 U1000 U1001 U1003 U1004 U1100 U1101 = 74xx-us:74*173: 4-bit D type REGISTER, 3-state
U205-U208 = 74xx-us:74*157: Quadruple 2-line to 1-line data SELECTOR/MULTIPLEXER
U209-U211 = 74xx-us:74*595: 8-bit SHIFT REGISTER, output latch
U212 U213 U219 U220 U301 U304 U401 U504 U505 U604 U702 U812 U1002 U1005 = 74xx-us:74*245: Octal BUS TRANSCEIVER, 3-state
U214 U303 U400 = 74xx-us:74*00: Quad 2-input NAND gate
U300 = 74xx-us:74*299: 8-bit universal SHIFT/STORAGE REGISTER
U500-U503 U901 U1102 = BW-Active:74*161: 4 bit counter
U700 U701 = 74xx-us:74*283: 4-bit binary FULL ADDER, fast carry
U703 U704 U806 U807 = 74xx-us:74*86: Quad 2-input EXCLUSIV-OR (XOR) gate
U705 U706 = 74xx-us:74*85: 4-bit magnitude COMPARATOR
U708 = 74xx-us:74*125: Quad bus BUFFER, 3-state
U709 U808-U811 = 74xx-us:74*153: Dual 4-line to 1-line data SELECTOR/MULTIPLEXER
U902 = 74xx-us:74*139: Dual 2-line to 4-line DECODER/DEMULTIPLEXER
U1106 U1107 = 74xx-us:74*154: 4-line to 16-line data SELECTOR/MULTIPLEXER
XU905 XU1103-XU1105 = memory:2864: MEMORY